# EAGLE design SensorNodePCB_set2_v2 (EAGLE 7.7.0)
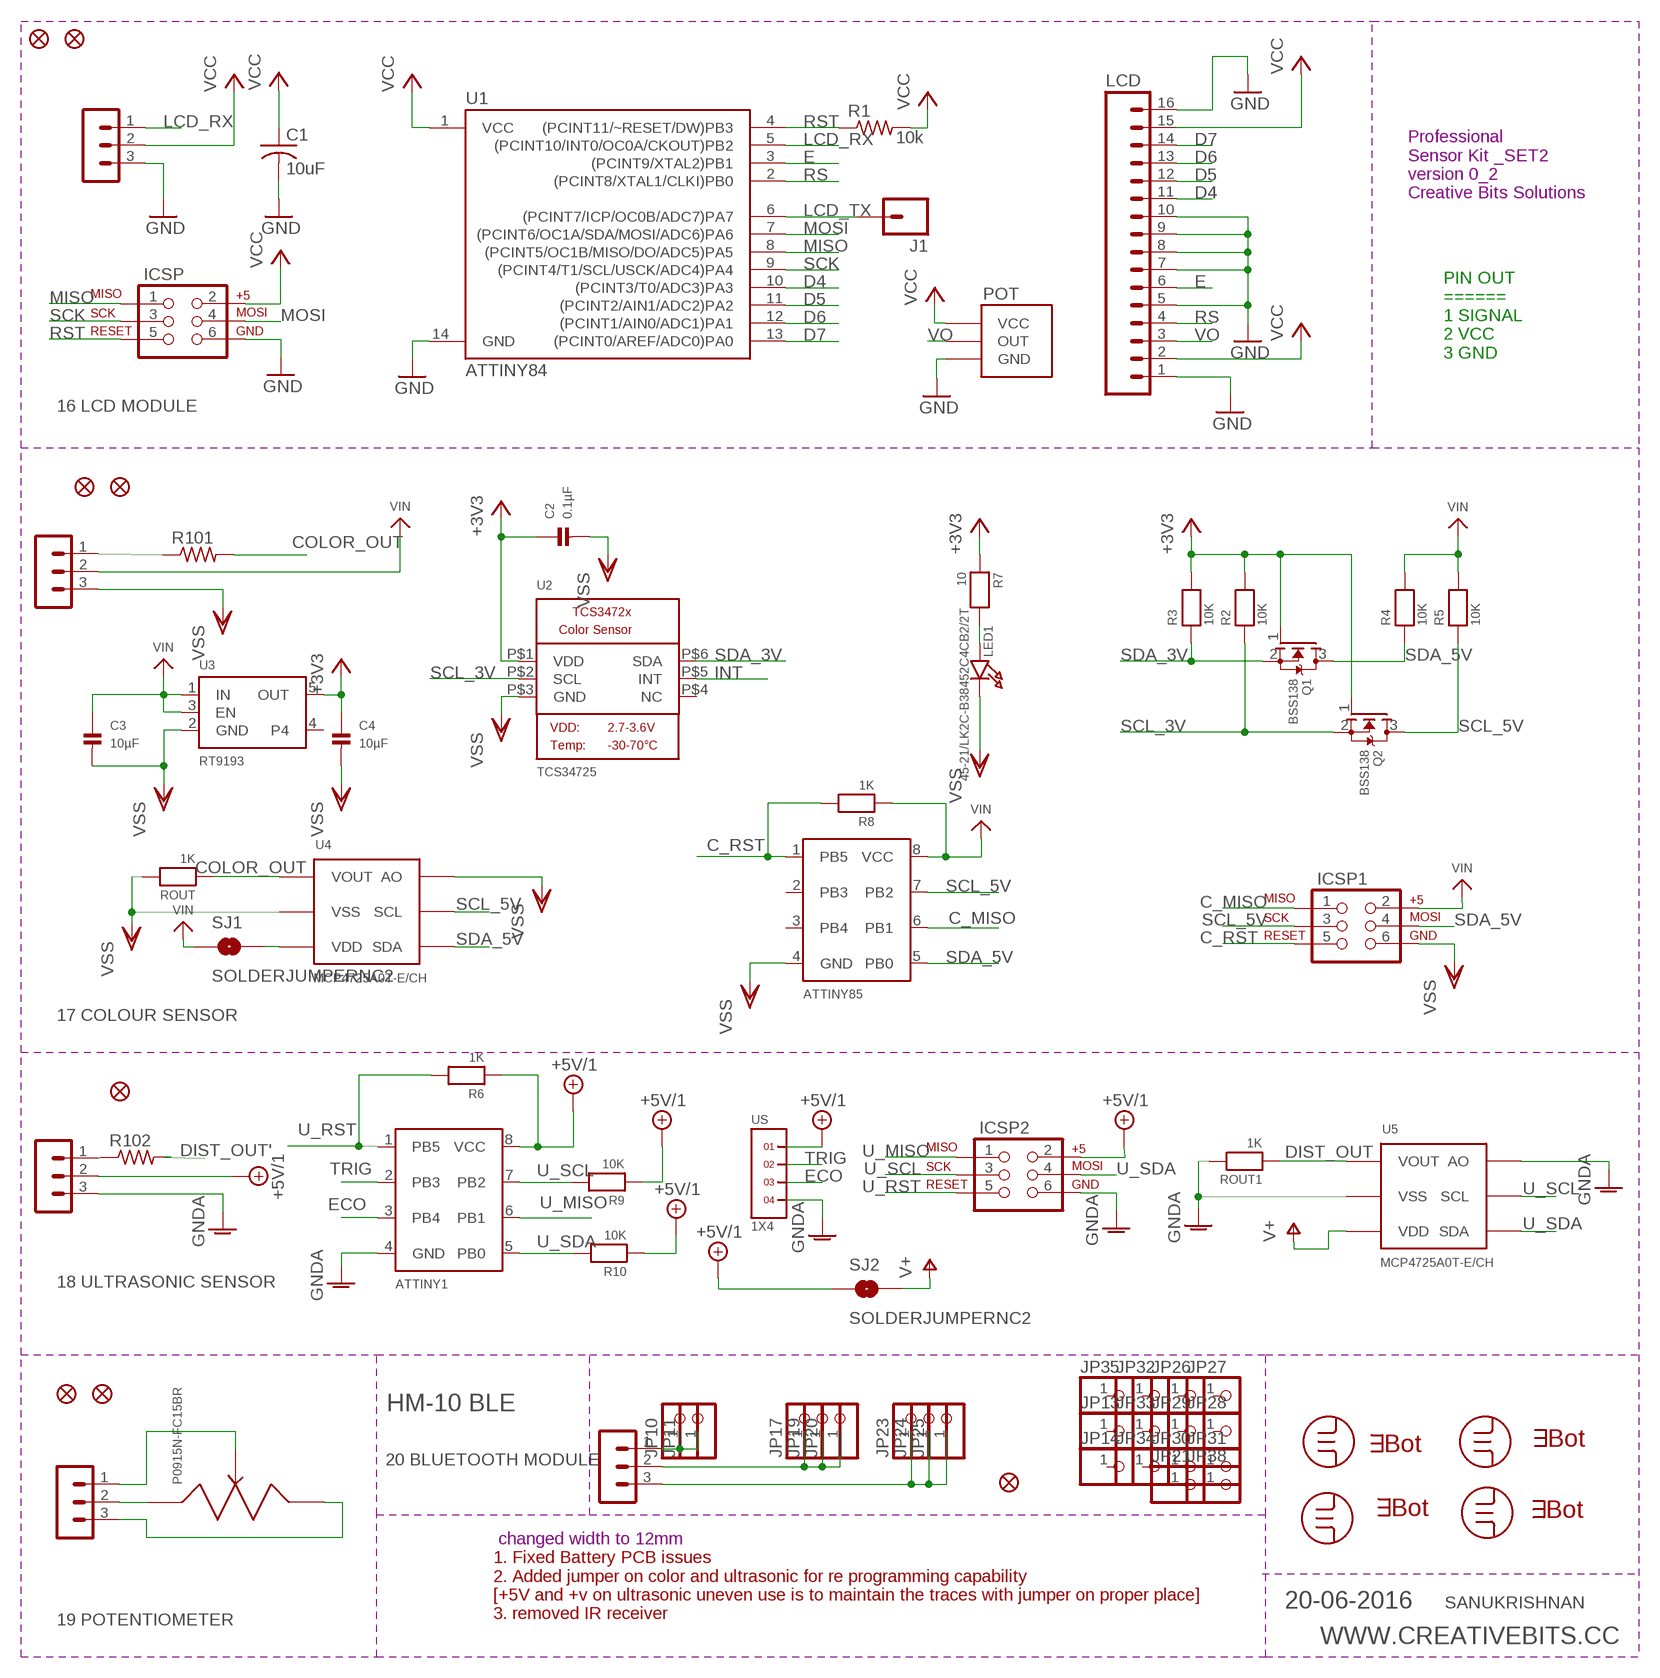
[diagram p0: schematic, sheet 1]

## Parts
ATTINY1  ATTINY45  [SOIC8]
ATTINY85  ATTINY45  [SOIC8]
C1  10uF  C-USC1206  [C1206]
C2  0.1µF  CAP_CERAMIC_0805  [_0805]
C3  10µF  CAP_CERAMIC_0805  [_0805]
C4  10µF  CAP_CERAMIC_0805  [_0805]
COLORSENSOR  MA03-1  [MA03-1]
ICSP  AVR_SPI_PRG_6NS  [2X3-NS]
ICSP1  AVR_SPI_PRG_6NS  [2X3-NS]
ICSP2  AVR_SPI_PRG_6NS  [2X3-NS]
J1  M01NOSILK-KIT  [1X01NS-KIT]
JP1  FIDUCIAL1X2  [FIDUCIAL-1X2]
JP2  FIDUCIAL1X2  [FIDUCIAL-1X2]
JP4  FIDUCIAL1X2  [FIDUCIAL-1X2]
JP6  FIDUCIAL1X2  [FIDUCIAL-1X2]
JP9  FIDUCIAL1X2  [FIDUCIAL-1X2]
JP10  PINHD-1X1CB  [1X01-CLEANBIG]
JP11  PINHD-1X1CB  [1X01-CLEANBIG]
JP12  FIDUCIAL1X2  [FIDUCIAL-1X2]
JP13  PINHD-1X1CB  [1X01-CLEANBIG]
JP14  PINHD-1X1CB  [1X01-CLEANBIG]
JP15  FIDUCIAL1X2  [FIDUCIAL-1X2]
JP17  PINHD-1X1CB  [1X01-CLEANBIG]
JP18  FIDUCIAL1X2  [FIDUCIAL-1X2]
JP19  PINHD-1X1CB  [1X01-CLEANBIG]
JP20  PINHD-1X1CB  [1X01-CLEANBIG]
JP21  PINHD-1X1CB  [1X01-CLEANBIG]
JP23  PINHD-1X1CB  [1X01-CLEANBIG]
JP24  PINHD-1X1CB  [1X01-CLEANBIG]
JP25  PINHD-1X1CB  [1X01-CLEANBIG]
JP26  PINHD-1X1CB  [1X01-CLEANBIG]
JP27  PINHD-1X1CB  [1X01-CLEANBIG]
JP28  PINHD-1X1CB  [1X01-CLEANBIG]
JP29  PINHD-1X1CB  [1X01-CLEANBIG]
JP30  PINHD-1X1CB  [1X01-CLEANBIG]
JP31  PINHD-1X1CB  [1X01-CLEANBIG]
JP32  PINHD-1X1CB  [1X01-CLEANBIG]
JP33  PINHD-1X1CB  [1X01-CLEANBIG]
JP34  PINHD-1X1CB  [1X01-CLEANBIG]
JP35  PINHD-1X1CB  [1X01-CLEANBIG]
JP38  PINHD-1X1CB  [1X01-CLEANBIG]
LCD  M16LONGPADS  [1X16_LONGPADS]
LCD_NODE  MA03-1  [MA03-1]
LED1  45-21/LK2C-B38452C4CB2/2T  LEDEV45-21  [EVERLIGHT_45-21]
POT  TRIMMER_EVN  [TRIMMER_EVN]
POT1  P0915N-FC15BR  [P0915N-FC15BR]
POTENTIOMETER  MA03-1  [MA03-1]
Q1  BSS138  MOSFET-NWIDE  [SOT23-WIDE]
Q2  BSS138  MOSFET-NWIDE  [SOT23-WIDE]
R1  10k  R-US_M0805  [M0805]
R2  10K  RESISTOR_0805  [_0805]
R3  10K  RESISTOR_0805  [_0805]
R4  10K  RESISTOR_0805  [_0805]
R5  10K  RESISTOR_0805  [_0805]
R6  1K  RESISTOR_0805  [_0805]
R7  10  RESISTOR_0805  [_0805]
R8  1K  RESISTOR_0805  [_0805]
R9  10K  RESISTOR_0805  [_0805]
R10  10K  RESISTOR_0805  [_0805]
R101  R-US_M0805  [M0805]
R102  R-US_M0805  [M0805]
ROUT  1K  RESISTOR_0805  [_0805]
ROUT1  1K  RESISTOR_0805  [_0805]
SJ1  SOLDERJUMPERNC2  [SJ_2S-NOTRACE]
SJ2  SOLDERJUMPERNC2  [SJ_2S-NOTRACE]
U1  ATTINY84  [SO14]
U2  TCS34725  LIGHT_TCS3472  [TCS3472_FN6]
U3  RT9193  VREG_SOT23-5  [SOT23-5]
U4  MCP4725  [MCP4725]
U5  MCP4725  [MCP4725]
U$30  EBOT_LOGO_6MMX6MM  [EBOT_6MMX6MM]
U$32  EBOT_LOGO_6MMX6MM  [EBOT_6MMX6MM]
U$33  EBOT_LOGO_6MMX6MM  [EBOT_6MMX6MM]
U$34  EBOT_LOGO_6MMX6MM  [EBOT_6MMX6MM]
U$35  EBOT_NAME_6MM  [EBOT_NAME_6MM]
U$37  EBOT_NAME_6MM  [EBOT_NAME_6MM]
U$38  EBOT_NAME_6MM  [EBOT_NAME_6MM]
U$39  EBOT_NAME_6MM  [EBOT_NAME_6MM]
ULTRASONICSENSOR  MA03-1  [MA03-1]
ULTRASONICSENSOR1  MA03-1  [MA03-1]
US  1X4  [1X4]

## Nets
+3V3: C2.1 C4.1 Q1.1(G) Q2.1(G) R2.2 R3.2 R7.1 U2.P$1(VDD) U3.5(OUT)
+5V/1: ATTINY1.8(VCC) ICSP2.2 R6.1 R9.1 R10.1 SJ2.1 ULTRASONICSENSOR.2 US.1
C_MISO: ATTINY85.6(PB1) ICSP1.1
C_RST: ATTINY85.1(PB5) ICSP1.5 R8.2
COLOR_OUT: R101.2 ROUT.1 U4.P$1(VOUT)
D4: LCD.11 U1.10((PCINT3/T0/ADC3)PA3)
D5: LCD.12 U1.11((PCINT2/AIN1/ADC2)PA2)
D6: LCD.13 U1.12((PCINT1/AIN0/ADC1)PA1)
D7: LCD.14 U1.13((PCINT0/AREF/ADC0)PA0)
DIST_OUT: R102.2 ROUT1.1 U5.P$1(VOUT)
DIST_OUT': R102.1 ULTRASONICSENSOR.1
E: LCD.6 U1.3((PCINT9/XTAL2)PB1)
ECO: ATTINY1.3(PB4) US.3
GND: C1.2 ICSP.6 LCD.1 LCD.5 LCD.7 LCD.8 LCD.9 LCD.10 LCD.16 LCD_NODE.3 POT.P$2(GND) U1.14(GND)
GNDA: ATTINY1.4(GND) ICSP2.6 ROUT1.2 U5.P$2(VSS) U5.P$6(AO) ULTRASONICSENSOR.3 US.4
INT: U2.P$5(INT)
LCD_RX: LCD_NODE.1 U1.5((PCINT10/INT0/OC0A/CKOUT)PB2)
LCD_TX: J1.1 U1.6((PCINT7/ICP/OC0B/ADC7)PA7)
MISO: ICSP.1 U1.8((PCINT5/OC1B/MISO/DO/ADC5)PA5)
MOSI: ICSP.4 U1.7((PCINT6/OC1A/SDA/MOSI/ADC6)PA6)
N$1: LED1.A R7.2
N$2: POT1.VCC POTENTIOMETER.2
N$3: SJ1.2 U4.P$3(VDD)
N$4: COLORSENSOR.1 R101.1
N$5: POT1.GND POTENTIOMETER.3
N$6: JP10.1 JP11.1 ULTRASONICSENSOR1.1
N$7: JP17.1 JP19.1 JP20.1 ULTRASONICSENSOR1.2
N$8: JP23.1 JP24.1 JP25.1 ULTRASONICSENSOR1.3
POT_OUT: POT1.OUT POTENTIOMETER.1
RS: LCD.4 U1.2((PCINT8/XTAL1/CLKI)PB0)
RST: ICSP.5 R1.1 U1.4((PCINT11/~RESET/DW)PB3)
SCK: ICSP.3 U1.9((PCINT4/T1/SCL/USCK/ADC4)PA4)
SCL_3V: Q2.2(S) R2.1 U2.P$2(SCL)
SCL_5V: ATTINY85.7(PB2) ICSP1.3 Q2.3(D) R5.1 U4.P$5(SCL)
SDA_3V: Q1.2(S) R3.1 U2.P$6(SDA)
SDA_5V: ATTINY85.5(PB0) ICSP1.4 Q1.3(D) R4.1 U4.P$4(SDA)
TRIG: ATTINY1.2(PB3) US.2
U_MISO: ATTINY1.6(PB1) ICSP2.1
U_RST: ATTINY1.1(PB5) ICSP2.5 R6.2
U_SCL: ATTINY1.7(PB2) ICSP2.3 R9.2 U5.P$5(SCL)
U_SDA: ATTINY1.5(PB0) ICSP2.4 R10.2 U5.P$4(SDA)
V+: SJ2.2 U5.P$3(VDD)
VCC: C1.1 ICSP.2 LCD.2 LCD.15 LCD_NODE.2 POT.P$1(VCC) R1.2 U1.1(VCC)
VIN: ATTINY85.8(VCC) C3.1 COLORSENSOR.2 ICSP1.2 R4.2 R5.2 R8.1 SJ1.1 U3.1(IN) U3.3(EN)
VO: LCD.3 POT.P$3(OUT)
VSS: ATTINY85.4(GND) C2.2 C3.2 C4.2 COLORSENSOR.3 ICSP1.6 LED1.K(C) ROUT.2 U2.P$3(GND) U3.2(GND) U4.P$2(VSS) U4.P$6(AO)
Unconnected: ATTINY85.2(PB3) ATTINY85.3(PB4) JP13.1 JP14.1 JP21.1 JP26.1 JP27.1 JP28.1 JP29.1 JP30.1 JP31.1 JP32.1 JP33.1 JP34.1 JP35.1 JP38.1 U2.P$4(NC) U3.4

## Notes on the sheet
- Professional
  Sensor Kit _SET2
  version 0_2
  Creative Bits Solutions
- PIN OUT
  ======
  1 SIGNAL
  2 VCC
  3 GND
- 16 LCD MODULE
- 17 COLOUR SENSOR
- 18 ULTRASONIC SENSOR
- HM-10 BLE
- 20 BLUETOOTH MODULE
- changed width to 12mm
- 20-06-2016 | SANUKRISHNAN
- 1. Fixed Battery PCB issues
  2. Added jumper on color and ultrasonic for re programming capability
  [+5V and +v on ultrasonic uneven use is to maintain the traces with jumper on proper place]
  3. removed IR receiver
- 19 POTENTIOMETER
- WWW.CREATIVEBITS.CC

## Library data of the parts
ATTINY1 ATTINY85 = attiny45:ATTINY45
C1 = adafruit:C-US: CAPACITOR, American symbol
C2-C4 = microbuilder:CAP_CERAMIC: Ceramic Capacitors 0402 - 0402 Surface Mount Capacitors 16pF 50V 5% [Digikey: 445-4899-2-ND] 18pF 50V 5% [Digikey: 490-1281-2-ND] 22pF 50V 5% [Digikey: 490-1283-2-ND] 68pF 50V 5% [Digikey: 490-1289-2-ND] 0.1uF 10V 10% [Digikey: 490-1318-2-ND] 1.0uF 6.3V 10% [Digikey: 490-1320-2-ND] 0603 - 0603 Surface Mount Capacitors 16 pF 50V 5% [Digikey: 445-5051-2-ND] 22 pF 50V [Digikey: PCC220ACVTR-ND] 33 pF 50V 5% [Digikey: 490-1415-1-ND] 56pF 50V 5% [Digikey: 490-1421-1-ND] 220pF 50V 5% [Digikey: 445-1285-1-ND] 680 pF 50V 2200 pF 50V 5% C0G [Digikey: 445-1297-1-ND] 5600 pF 100V 5% X7R [Digikey: 478-3711-1-ND] 0.1 µF 25V 10% [Digikey: PCC2277TR-ND] 0.22 µF 16V 10% X7R [Digikey: 445-1318-1-ND] 1.0 µF 25V 10% [Digikey: 445-5146-2-ND] 0603 - RF Specific 3pF 250V +/-0.1pF RF [Digikey: 712-1347-1-ND] 18 pF 250V 5% [Digikey: 478-3505-1-ND or 712-1322-1-ND] 56 pF 250V 5% C0G RF [Digikey: 490-4867-1-ND] 68 pF 250V RF [Digikey: 490-4868-1-ND] 0805 - 0805 Surface Mount Capacitors 220 pF 250V 2% RF Ceramic Capacitor [Digikey: 712-1398-1-ND] 1000 pF 50V 2% NP0 Ceramic Capacitor [Digikey: 478-3760-1-ND] 0.1 µF 25V 10% Ceramic Capacitor [Digikey: PCC1828TR-ND] 1.0 µF 16V 10% Ceramic Capacitor[Digikey: 490-1691-2-ND] 10.0 µF 10V 10% Ceramic Capacitor[Digikey: 709-1228-1-ND] 10.0 uF 16V 10% Ceramic Capacitor [Digikey: 478-5165-2-ND] 47 uF 6.3V 20% Ceramic Capacitor [Digikey: 587-1779-1-ND or 399-5506-1-ND] 1206 - 1206 Surface Mount Capacitors 47uF 10V 20% Ceramic Capacitor [Digikey: 490-5528-1-ND or 399-5508-1-ND or 445-6010-1-ND] 100uF 6.3V -20%, +80% Y5V Ceramic Capacitor (Digikey: 490-4512-1-ND, Mouser: 81-GRM31CF50J107ZE1L)
COLORSENSOR LCD_NODE POTENTIOMETER ULTRASONICSENSOR ULTRASONICSENSOR1 = con-lstb:MA03-1: PIN HEADER; OC_FARNELL: unknown; OC_NEWARK: unknown
ICSP ICSP1 ICSP2 = SparkFun-Connectors:AVR_SPI_PRG_6: AVR ISP 6 Pin This is the reduced ISP connector for AVR programming. Common on Arduino. This footprint will take up less PCB space and can be used with a 10-pin to 6-pin adapter such as SKU: BOB-08508 **Special note about "TEST_POINT" package. The stop mask is on the top side, so if you want your programming test points to be on the bottom of your board, make sure to place this package on the bottom side of the board. This also ensure that the orientation to program from the bottom side will be correct.
J1 = SparkFun-Connectors:M01: Header 1 Standard 1-pin 0.1" header. Use with straight break away headers (SKU : PRT-00116), right angle break away headers (PRT-00553), swiss pins (PRT-00743), machine pins (PRT-00117), and female headers (PRT-00115). SMTSO-256-ET is a "flush mount" nut for a 4-40 screw. The older package used to be too tight, and did not allow it to sit properly thru the drill hit. The latest (0.165DIA) fits nice and snug.
JP1 JP2 JP4 JP6 JP9 JP12 JP15 JP18 = attiny84SparkFun:FIDUCIAL: Fiducial Alignment Points Various fiducial points for machine vision alignment.
JP10 JP11 JP13 JP14 JP17 JP19-JP21 JP23-JP35 JP38 = adafruit:PINHD-1X1: Pin header 1x1 for 0.1" spacing With round pins
LCD = SparkFun-Connectors:M16: 1x16 .1" header
LED1 = microbuilder:LED: LED 0603 - 0603 Surface Mount Package 2mA: Green LED - Low Power (3.9mcd, 2ma, 1.7Vf) - Digikey: 475-2709-2-ND Orange LED - Low Power (9.8mcd, 2ma, 1.8Vf) - Digikey: 475-1194-2-ND Red LED - Low Power (5mcd, 2ma, 1.8Vf) - Digikey: 475-1195-2-ND Yellow LED - Low Power (7mcd, 2ma, 1.8Vf) - Digikey: 475-1196-2-ND 5mA: Blue LED - Low Power (17mcd, 5ma, 2.9Vf) - Digikey: LNJ937W8CRACT-ND 0805 - 0805 Surface Mount Package 2mA: Red LED (8.8mcd, 2mA, 1.8Vf, Clear) - Low Power [Digikey: 475-2510-1-ND] Green LED (5mcd, 2mA, 1.8Vf, Clear) - Low Power [Digikey: 475-2730-1-ND] Yellow LED (11.3mcd, 2mA, 1.8Vf, Clear) - Low Power [Digikey: 475-2555-1-ND] 20mA: Red LED (104mcd, 20mA, Diffused) - LS R976 [Digikey: 475-1278-6-ND] Red LED (12mcd, 20mA, 2.0Vf, Clear) - APT2012EC [Digikey: 754-1128-1-ND] Green LED (15mcd, 20mA, 2.2Vf, Clear) - APT2012GC [Digikey: 754-1131-1-ND] Orange LED (160mcd, 20mA, 2.1Vf, Clear) - APT2012SECK [Digikey: 754-1130-1-ND] 1206 - 1206 Surface Mount Package Green LED (26mcd, 20mA, Diffused) - LG N971 [Digikey: 475-1407-6-ND] Red LED (15mcd, 20mA, Diffused) - LH N974 [Digikey: 475-1416-6-ND] Cree - Cree High-Power Surface Mount LEDs XPEBWT-L1-0000-00D50 - White 111lm 350mA 2.9Vf 6200K 110° XTEAWT-00-0000-00000LEE3 - White 114lm 350mA 2.85Vf 5000K 115° Everlight - Everlight 45-21 Series Surface Mount LEDs 45-21/QK2C-B2832AC2CB2/2T - Warm White 2000mcd 20mA 3.25Vf 3050K 120° 45-21/LK2C-B38452C4CB2/2T - Nuetral White 2000mcd 20mA 3.25Vf 4150K 120° 45-21/LK2C-B50634C6CB2/2T - Cold White 2200mcd 20mA 3.25Vf 5650K 120°
POT = TRIMMER:TRIMMER_EVN
POT1 = P0915N-FC15BR:P0915N-FC15BR
Q1 Q2 = microbuilder:MOSFET-N: N-Channel Mosfet LEGEND VDS: Voltage Drain-Source ID: Drain Current RDS(ON): Drain-Source On-State Resistance VGS(TH): Gate-Source Threshold Voltage CISS: Drain-Source Input Capacitance SOT-23 Name VDS ID RDS(ON) VGS(TH) CISS Order Number 2N7002E 60V 260mA 2.5 Ohm 2.5V @ 250uA 26.7pF @ 25V 2N7002ET1GOSTR-ND BSH103 30V 850mA 400 mOhm 400mV @ 1mA 83pF @ 24V BSH103,235-ND BSS138 60V 320mA 1.6 Ohm 1.5V @ 250uA 50pF @ 10V Mouser: 771-BSS138PW115 DMN2075U-7 20V 4.2A 38 mOhm 1V @ 250 uA 594.3pF @ 10V DMN2075U-7DICT-ND * BSS138 good choice for I2C level-shifting
R1 R101 R102 = adafruit:R-US_: RESISTOR, American symbol
R2-R10 ROUT ROUT1 = microbuilder:RESISTOR: Resistors 0402 - 0402 Surface Mount Package 22 Ohm 1% 1/16W [Digikey: 311-22.0LRTR-ND] 33 Ohm 5% 1/16W 1.0K 5% 1/16W 1.5K 5% 1/16W 2.0K 1% 1/16W 10.0K 1% 1/16W [Digikey: 311-10.0KLRTR-ND] 10.0K 5% 1/16W [Digikey: RMCF0402JT10K0TR-ND] 12.1K 1% 1/16W [Digikey: 311-22.0LRTR-ND] 100.0K 5% 1/16W 0603 - 0603 Surface Mount Package 0 Ohm 1/10 Watt 1% Resistor 15 Ohm 1/10 Watt 1% Resistor 33 Ohm 1/10 Watt 1% Resistor 49.9 Ohm 1/10 Watt 1% Resistor 100 Ohm 1/10 Watt 1% Resistor 150 Ohm 1/10 Watt 1% Resistor 240 Ohm 1/10 Watt 1% Resistor 390 Ohm 1/10 Watt 1% Resistor 560 Ohm 1/10 Watt 1% Resistor 680 Ohm 1/10 Watt 1% Resistor 750 Ohm 1/10 Watt 1% Resistor 1.0K Ohm 1/10 Watt 1% Resistor 1.5K Ohm 1/10 Watt 1% Resistor 2.0K Ohm 1/10 Watt 1% Resistor 2.2K Ohm 1/10 Watt 1% Resistor 3.3K Ohm 1/10 Watt 1% Resistor 4.7K Ohm 1/10 Watt 1% Resistor 10.0K Ohm 1/10 Watt 1% Resistor 12.0K Ohm 1/10 Watt 1% Resistor 12.1K Ohm 1/10 Watt 1% Resistor 20.0K Ohm 1/10 Watt 1% Resistor 33.0K Ohm 1/10 Watt 1% Resistor 100.0K Ohm 1/10 Watt 1% Resistor 0805 - 0805 Surface Mount Package 0 Ohm 1/8 Watt 1% Resistor 33 Ohm 1/8 Watt 1% Resistor 100 Ohm 1/8 Watt 1% Resistor 150 Ohm 1/8 Watt 1% Resistor 200 Ohm 1/8 Watt 1% Resistor 240 Ohm 1/8 Watt 1% Resistor 330 Ohm 1/8 Watt 1% Resistor 390 Ohm 1/8 Watt 1% Resistor 470 Ohm 1/8 Watt 1% Resistor 1.0K Ohm 1/8 Watt 1% Resistor 1.5K Ohm 1/8 Watt 1% Resistor 2.0K Ohm 1/8 Watt 1% Resistor 4.7K Ohm 1/8 Watt 1% Resistor 5.1K Ohm 1/8 Watt 1% Resistor 5.6K Ohm 1/8 Watt 1% Resistor 10.0K Ohm 1/8 Watt 1% Resistor 22.0K Ohm 1/8 Watt 1% Resistor 33.0K Ohm 1/8 Watt 1% Resistor 100K Ohm 1/8 Watt 1% Resistor 1206 - 1206 Surface Mount Package 2012 - 2010 Surface Mount Package 0.11 Ohm 1/2 Watt 1% Resistor - Digikey: RHM.11UCT-ND
SJ1 SJ2 = SparkFun-Passives:SOLDERJUMPER: Solder Jumper Standard SMD solder jumper. Used to automate production. Two varients : Normally Open and Normally Closed are the same, but have different paste layers. NC will have a large amount of paste and should jumper during reflow.
U1 = SparkFun-DigitalIC:ATTINY84: Atmel 14-pin 2/4/8kB flash uC; PROD_ID: IC-11285
U2 = microbuilder:LIGHT_TCS3472: TCS3472 RGB + Clear Color Sensor VDD: 2.7-3.6V Temp: -30 - 70°C IR light blocking filter 3,800,000:1 Dynamic Range 2.5µA sleep state Part IDs TCS34725: I2C bus logic = VDD, I2C address: 0x29 TCS34727: I2C bus logic = 1.8V, I2C address: 0x29
U3 = microbuilder:VREG_SOT23-5: SOT23-5 Fixed Voltage Regulators To better organise some of the SOT23-5 fixed voltage regulators in this library, this new part was created. Part Current Out V Out V In V Dropout Digikey Part No. ADP121 150mA 3.3V 3.4-5.5V 0.09V @ 150mA ADP121-AUJZ33R7CT-ND ADP121 150mA 3.0V 3.1-5.5V 0.09V @ 150mA ADP121-AUJZ30R7CT-ND ADP122 300mA 3.3V 3.4-5.5V 0.085V @ 300mA ADP122AUJZ-3.3-R7CT-ND ADP1712 300mA 3.3V 3.5-5.5V 0.17V @ 300mA ADP1712AUJZ-3.3-R7TR-ND AP7311 (Low Cost) 150mA 3.3V 3.5-6V 0.15V @ 150mA AP7311-33WG-7DICT-ND LD39015M18R 150mA 1.8V 1.9V-5.5V 0.08V @ 100mA 497-6977-1-ND MCP1824T-3302E/OT 300mA 3.3V 3.5V-6V 0.2V @ 300mA MCP1824T-3302E/OTCT-ND MIC5205-2.5YM5 TR 150mA 2.5V 2.7-16V 0.165V @ 150mA 576-1257-2-ND MIC5205-3.0YM5 TR 150mA 3.0V 3.2V-16V 0.165V @ 150mA 576-1258-2-ND MIC5205-3.3YM5 TR 150mA 3.3V 3.5V-16V 0.165V @ 150mA 576-1259-2-ND TPS780330220 150mA 3.3V+2.2V 3.6-5.5V 250mV Max 296-23332-1-ND TDA3663/N1,135 100mA 3.3V 3.5-45V 0.18V @ 50mA 568-5343-1-ND
U4 U5 = MCP4725:MCP4725
U$30 U$32-U$34 = EbotLogos:EBOT_LOGO_6MMX6MM
U$35 U$37-U$39 = EbotLogos:EBOT_NAME_6MM
US = headers(.1in):1X4

## Net classes
0 default: width 0.178 mm, drill 0.305 mm, clearance 0.178 mm

## Board
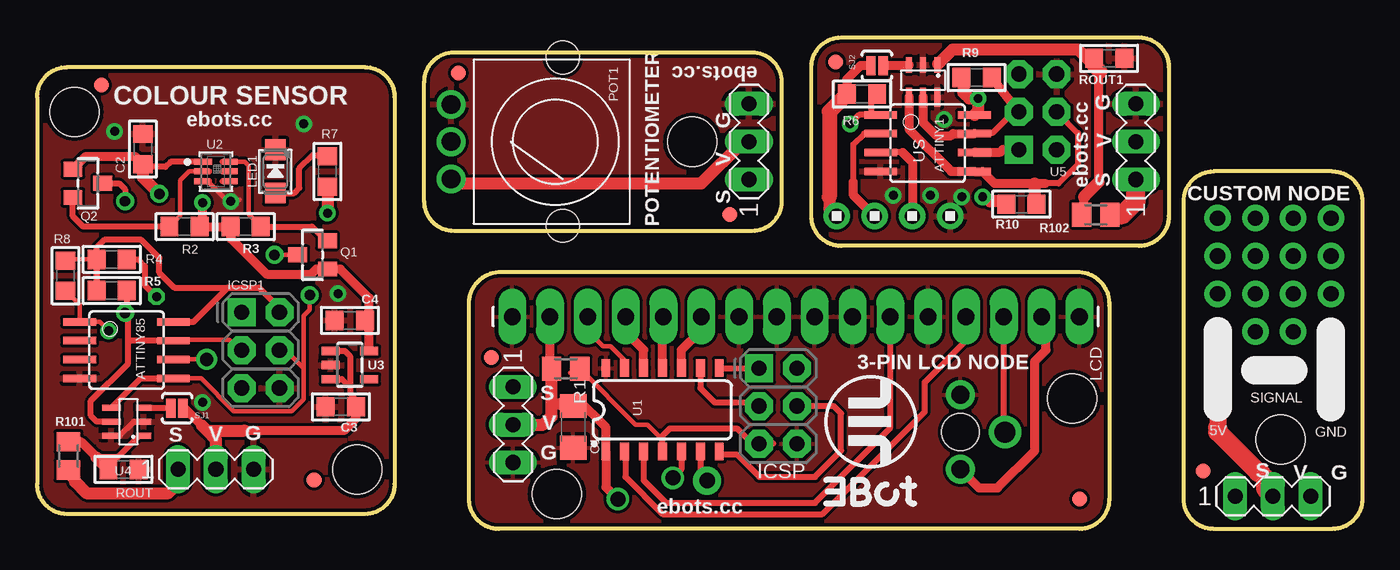
[diagram p1: board, top side]
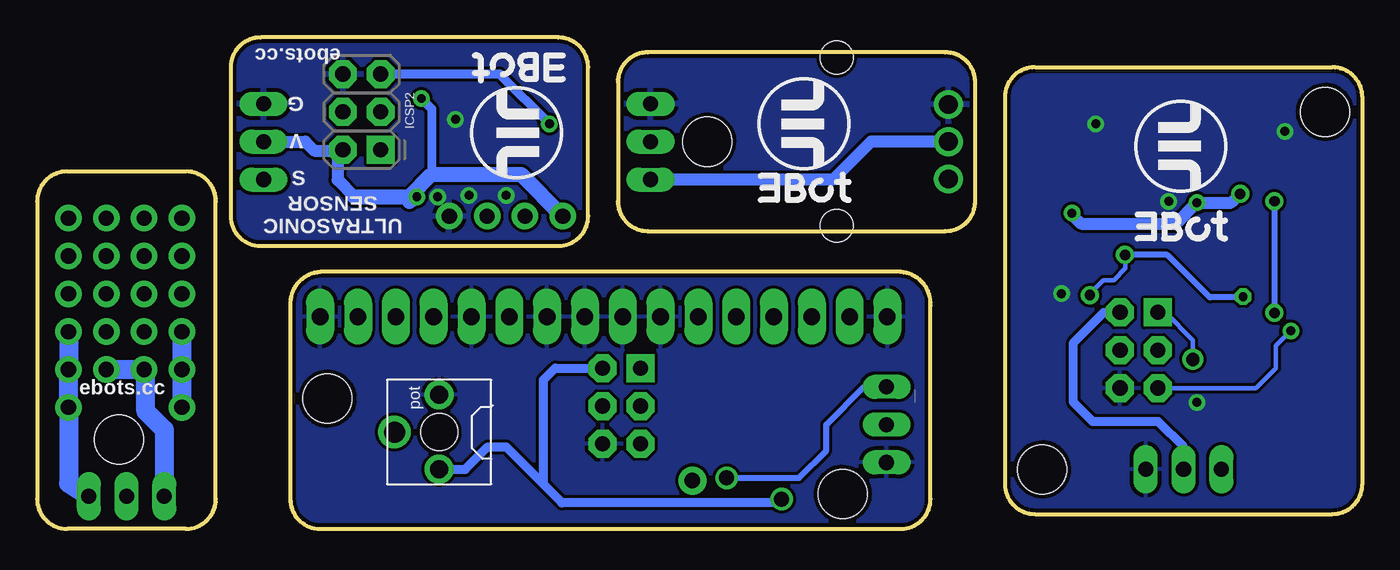
[diagram p2: board, bottom side, seen from below]

Size 89 x 33 mm. Coordinates in mm from the lower left corner, seen from the top.
Outline: 26,22 26,30 arc-90 28,32 48,32 arc-90 50,30 50,22 arc-90 48,20 28,20 arc-90 26,22
Outline: 52,21 52,31 arc-90 54,33 74,33 arc-90 76,31 76,21 arc-90 74,19 54,19 arc-90 52,21
Outline: 22,31 2,31 arc90 0,29 0,3 arc90 2,1 22,1 arc90 24,3 24,29 arc90 22,31
Outline: 29,2 29,15 arc-90 31,17.25 70,17.25 arc-90 72,15 72,2 arc-90 70,0 31,0 arc-90 29,2
Outline: 87,24 arc-90 89,22 89,2 arc-90 87,0 79,0 arc-90 77,2 77,22 arc-90 79,24 87,24
Copper layers (1*16): Top 0.035mm / dielectric 1.5mm / Bottom 0.035mm
Design rules "SparkFun": minimum track width 8mil, minimum drill 20mil, track to track 8mil, track to pad 8mil, pad to pad 8mil, via to via 8mil, smd to smd 8mil, copper to edge 10mil, drill to drill 8mil, minimum pad ring 12mil, minimum via ring 10mil, stop-mask expansion 4mil, vias tented up to drill 25mil, thermal gap 10mil

### Footprints (pad centres in the part's own frame; a part is rotated, then mirrored left to right if it is on the bottom)
SOIC8 = smd 0.5 x 2.2: 1 -1.905,-3.154; 2 -0.645,-3.154; 3 0.625,-3.154; 4 1.895,-3.154; 5 1.905,3.154; 6 0.635,3.154; 7 -0.635,3.154; 8 -1.905,3.154
C1206 = smd 1.6 x 1.8: 1 -1.4,0; 2 1.4,0
_0805 = smd 1.2 x 1.3: 1 -1.016,0; 2 1.016,0
MA03-1 = drill 1.016 long: 1 -2.54,0; 2 0,0; 3 2.54,0
2X3-NS = drill 1.016 pad 1.88 square: 1 -2.54,-1.27 | drill 1.016 pad 1.88 octagon: 2 -2.54,1.27; 3 0,-1.27; 4 0,1.27; 5 2.54,-1.27; 6 2.54,1.27
1X01NS-KIT = drill 1.016 pad 1.88: 1 0,0
FIDUCIAL-1X2 = smd 1 x 1: 1 0,0
STAND-OFF = hole 3.302: 0,0
1X01-CLEANBIG = drill 1.016 pad 1.778: 1 0,0
1X16_LONGPADS = drill 1.118 pad 1.88 long: 1 0,0; 2 2.54,0; 3 5.08,0; 4 7.62,0; 5 10.16,0; 6 12.7,0; 7 15.24,0; 8 17.78,0; 9 20.32,0; 10 22.86,0; 11 25.4,0; 12 27.94,0; 13 30.48,0; 14 33.02,0; 15 35.56,0; 16 38.1,0
EVERLIGHT_45-21 = smd 1.4 x 1.4: A -1.45,0; K 1.45,0
TRIMMER_EVN = drill 1.2 pad 1.93: P$1 -2.5,0; P$2 2.5,0 | drill 1.4 pad 2.184: P$3 0,3 | hole 2.5: 0,0
P0915N-FC15BR = drill 1.25 pad 1.93: GND -2.5,0; OUT 0,0; VCC 2.5,0 | hole 2.2: 5.65,7.5; -5.65,7.5
SOT23-WIDE = smd 1 x 1.27: 1 -0.95,-1; 2 0.95,-1; 3 0,1
M0805 = smd 1.3 x 1.6: 1 -0.95,0; 2 0.95,0
SJ_2S-NOTRACE = smd 0.635 x 1.27: 1 -0.401,0; 2 0.413,0
SO14 = smd 0.6 x 1.2: 1 -3.81,-2.8; 2 -2.54,-2.8; 3 -1.27,-2.8; 4 0,-2.8; 5 1.27,-2.8; 6 2.54,-2.8; 7 3.81,-2.8; 8 3.81,2.8; 9 2.54,2.8; 10 1.27,2.8; 11 0,2.8; 12 -1.27,2.8; 13 -2.54,2.8; 14 -3.81,2.8
TCS3472_FN6 = smd 1.2 x 0.4: P$1 -0.85,0.65 | smd 1 x 0.4: P$2 -0.95,0; P$3 -0.95,-0.65; P$4 0.95,-0.65; P$5 0.95,0; P$6 0.95,0.65
SOT23-5 = smd 0.55 x 1.2: 1 -0.95,-1.3; 2 0,-1.3; 3 0.95,-1.3; 4 0.95,1.3; 5 -0.95,1.3
MCP4725 = smd 0.4 x 1.016: P$1 -0.95,-1.15; P$2 0,-1.15; P$3 0.95,-1.15 | smd 0.4 x 1.27: P$4 0.95,1.016; P$5 0,1.016; P$6 -0.95,1.016
1X4 = drill 1.016 pad 1.778: 1 0,0; 2 2.54,0; 3 5.08,0; 4 7.62,0

### Placement (x,y rotation side)
ATTINY1  59.8,25.9 270 top
ATTINY85  6,12 270 top
C1  36,6.85 270 top
C2  7.1,25.5 90 top
C3  20.4,8.2 180 top
C4  21,14 180 top
COLORSENSOR  12,4 0 top
ICSP  49.75,8.25 270 top
ICSP1  15,12 270 top
ICSP2  67.2,28 90 bottom
J1  45,3.25 90 top
JP1  28.3,30.6 0 top
JP2  30.5,11.5 90 top
JP3  STAND-OFF  [STAND-OFF]  69.5,8.75 180 top
JP4  70,2 90 top
JP5  STAND-OFF  [STAND-OFF]  2.5,28 0 top
JP6  46.5,21.1 0 top
JP7  STAND-OFF  [STAND-OFF]  83.5,6 90 top
JP8  STAND-OFF  [STAND-OFF]  21.5,4 0 top
JP9  78.3,3.9 0 top
JP10  81.82,10.7 0 top
JP11  84.36,10.7 0 top
JP12  18.6,3.3 0 top
JP13  86.9,20.86 0 top
JP14  84.36,20.86 0 top
JP15  53.64,31.34 0 top
JP16  STAND-OFF  [STAND-OFF]  44,26 90 top
JP17  79.28,8.16 0 top
JP18  4.3,29.8 0 top
JP19  79.28,13.24 0 top
JP20  79.28,10.7 0 top
JP21  81.82,20.86 0 top
JP22  STAND-OFF  [STAND-OFF]  34.9,2.35 180 top
JP23  86.9,8.16 0 top
JP24  86.9,10.7 0 top
JP25  86.9,13.24 0 top
JP26  81.82,18.32 0 top
JP27  84.36,18.32 0 top
JP28  86.9,18.32 0 top
JP29  84.36,13.24 0 top
JP30  79.28,15.78 0 top
JP31  86.9,15.78 0 top
JP32  81.82,13.24 0 top
JP33  84.36,15.78 0 top
JP34  81.82,15.78 0 top
JP35  79.28,18.32 0 top
JP38  79.28,20.86 0 top
LCD  70,14.25 180 top
LCD_NODE  31.95,7 270 top
LED1  16,24 90 top
POT  62,6.5 90 bottom
POT1  27.8,26 270 top
POTENTIOMETER  47.8,26 90 top
Q1  18.5,18.4 90 top
Q2  3.4,23.2 270 top
R1  35.5,10.75 180 top
R2  9.9,20.3 0 top
R3  14,20.3 180 top
R4  5,18.1 180 top
R5  5,16 180 top
R6  55.4,29.2 0 top
R7  19.5,24 90 top
R8  1.9,17 270 top
R9  63.1,30.3 0 top
R10  66.1,21.8 0 top
R101  2.1,4.9 90 top
R102  71.1,21.1 180 top
ROUT  5.8,4 0 top
ROUT1  72,31.6 0 top
SJ1  9.4,8.1 180 top
SJ2  56.4,31.1 0 top
U1  42,8 0 top
U2  12,24 0 top
U3  21,11 270 top
U4  6,7.2 90 top
U5  59.5,30 180 top
U$30  56,7.2 0 top
U$32  37.5,27.2 0 bottom
U$33  56.8,26.6 180 bottom
U$34  12.2,25.7 0 bottom
U$35  53,1.6 0 top
U$37  40.4,22 0 bottom
U$38  53.7,31.9 180 bottom
U$39  15.1,19.4 0 bottom
ULTRASONICSENSOR  73.8,26 90 top
ULTRASONICSENSOR1  83,2.2 0 top
US  53.7,21 0 top

### Tracks (layer width: path | path; a pad name or v marks a point on that pad's centre or on a via)
+3V3  (via drill 0.6, 0.7)
  Top 0.305: 11.1,24.7 U2.P$1
  Top 0.406: 22.3,13.72 C4.1 22,14.02 | 19.25,17.2 Q1.1 | U2.P$1 8.95,24.65 8.6,24.3 7.28,24.3 C2.1
  Top 0.61: U3.5 22.3,14.1 | 22.3,14.1 22.3,15.5 20.35,17.45 Q1.1 18.75,17.45 18.4,17.1 15.4,17.1 12.98,19.52 R3.2 R2.2 11.1,20.48 v11.1,21.9 | C4.1 22.12,14.1 22.3,14.1 | Q2.1 3.27,25.02 6.57,25.02 C2.1
  Top 0.813: C2.1 7.1,23.6 v8.2,22.5 | R7.1 v19.5,21.2
  Bottom 0.813: v8.2,22.5 8.8,21.9 v11.1,21.9 12.5,20.5 18.9,20.5 19.5,21.1 v19.5,21.2
+5V/1  (via drill 0.6)
  Top 0.61: SJ2.1 55.3,31.1 54.38,30.18 R6.1
  Top 0.813: 53.2,22.3 53.2,21.5 US.1 | R10.1 64.88,22 64,22 63.7,22.3 v63.5,22.3 | R9.1 62.2,30.18 62.2,29.3 62.6,28.9 v63.2,28.9 63.2,28.05 ATTINY1.8
  Top 1.016: R6.1 53.2,28.02 53.2,22.3
  Bottom 0.61: v63.2,28.9 62.5,28.2 62.5,23.8
  Bottom 0.813: ULTRASONICSENSOR.2 71,26 70.4,25.4 68.83,25.4 | 68.83,25.4 ICSP2.2 | 68.83,25.4 68.83,23.43 67.7,22.3
  Bottom 1.016: 67.7,22.3 64,22.3 | 64,22.3 62.5,23.8 56.5,23.8 US.1 | v63.5,22.3 64,22 64,22.3
C_MISO  (via drill 0.9)
  Top 0.305: ATTINY85.6 9.19,11.4 v11.38,11.38
  Bottom 0.305: ICSP1.1 13.24,14.54 11.38,12.68 v11.38,11.38
C_RST  (via drill 0.6)
  Top 0.305: R8.2 2.85,15.04 ATTINY85.1 4.2,13.9 v4.8,13.3
  Bottom 0.305: ICSP1.5 7.14,9.46 5.8,10.8 5.8,12.3 v4.8,13.3
COLOR_OUT
  Top 0.406: U4.P$1 6.85,6.25 5.4,4.8 4,4.8 3.99,4.79
  Top 0.61: 4,4.8 2.95,5.85 R101.2
  Top 0.813: 3.99,4.79 ROUT.1
D4
  Top 0.61: U1.10 43.27,12.02 44.5,13.25 44.5,14.9 LCD.11
D5
  Top 0.61: U1.11 42,14.94 LCD.12
D6
  Top 0.61: U1.12 40.73,12.02 39.5,13.25 39.5,14.98 LCD.13
D7
  Top 0.305: U1.13 39.5,10.84 39.5,11.25 38.5,12.25 38,12.25 36.98,13.27 LCD.14
DIST_OUT
  Top 0.6: 71.3,23.3 71.3,30.8
  Top 0.61: U5.P$1 60.5,31.2 | R102.2 70.15,21.45 70.35,21.65 70.3,21.7 70.3,22.3
  Top 0.813: 60.5,31.2 61.5,32.2 69.9,32.2 71.3,30.8 | 70.3,22.3 71.3,23.3
  Top 1.016: 71.4,30.7 71.3,30.8 70.98,31.12 ROUT1.1
DIST_OUT'
  Top 0.61: 73.8,21.55 73.8,22
  Top 1.27: R102.1 72.9,21.1 73.8,22 ULTRASONICSENSOR.1
E
  Top 0.406: U1.3 40.75,5.18 40.75,3.25 42.25,1.75 52.25,1.75 57.3,6.8 LCD.6
ECO
  Top 0.406: 58.12,25.27 ATTINY1.3
  Top 0.61: 58.12,25.27 58.78,24.62 US.3
GND
  pour Top: 28,0 72,0 71.75,17.25 27.75,17.25
  pour Bottom: 29,0 72,0 72,17.25 29,17.25
GNDA  (via drill 0.6)
  other vias: 57.5,22.4 62.1,22.3 60.9,27.5 60,22.4
  pour Bottom: 52.3,32.7 52.3,19.1 76.3,19.2 75.9,33
  pour Top: 52.6,18.9 52.5,32.5 76.1,33.1 75.9,19
LCD_RX  (via drill 1)
  Top 0.406: U1.5 43.27,4 v42.7,3.43
  Bottom 0.406: 31.71,9.54 LCD_NODE.1 33.46,9.54 36,7 36,5.25 37.82,3.43 v42.7,3.43
LCD_TX
  Top 0.406: U1.6 44.54,3.71 J1.1
MISO
  Top 0.406: U1.8 ICSP.1
MOSI
  Top 0.406: U1.7 46.01,5 47,5 48.5,3.5 52.25,3.5 54,5.25 54,7.75 53.5,8.25 ICSP.4
N$1
  Top 0.406: LED1.A 17.25,22.55 17.6,22.9 17.6,24.2 18.5,25.1 19.42,25.1 R7.2
N$2
  Top 0.813: POT1.VCC 28.3,23.2 44.6,23.2 47.4,26 POTENTIOMETER.2
N$3
  Top 0.406: U4.P$3 8.94,8.15 SJ1.2
N$4
  Top 0.61: 2.55,3.15 2.1,3.6 R101.1
  Top 0.813: 2.55,3.15 3.3,2.4 8.8,2.4 9.4,3 9.4,3.94 COLORSENSOR.1
N$5
  pour Bottom: 26.5,33 26.3,19 50.1,19.1 50,32.7
  pour Top: 26,19 26.3,32.9 49.8,32.7 50,18.9
N$6
  Bottom 1.27: ULTRASONICSENSOR1.1 80.46,6.66 81.7,7.9 81.7,10.58 JP10.1 JP11.1
N$7
  Top 1.143: JP17.1 79.28,6.82
  Top 1.24: 79.28,6.52 82,3.8
  Top 1.27: 83,3.1 ULTRASONICSENSOR1.2 82.5,2.7 82.5,3.4 82.1,3.8 82,3.8 | 79.28,6.82 79.28,6.52
  Bottom 1.27: JP19.1 JP20.1 JP17.1
N$8
  Bottom 1.27: JP25.1 JP24.1 JP23.1 86.9,3.06 ULTRASONICSENSOR1.3
POT_OUT
  Bottom 0.813: POT1.OUT 33,26 35.54,23.46 POTENTIOMETER.1
RS
  Top 0.305: U1.2 39.5,5.16
  Top 0.406: 39.5,5.16 39.5,3.5 42,1 52.75,1 59.61,7.86 59.61,9.86 62.38,12.63 LCD.4
RST
  Top 0.305: 42,5.75 42,6 41,7 40.2,7 R1.1 35.8,10.5
  Top 0.406: U1.4 42,5.75 42,6.25 42.5,6.75 47,6.75 48,5.75 49.44,5.75 ICSP.5
SCK
  Top 0.406: U1.9 44.54,9.46 45.5,8.5 49.23,8.5 ICSP.3
SCL_3V
  Top 0.305: R2.1 9.6,21.02 9.6,23.4 10.2,24 U2.P$2
  Top 0.406: R2.1 3.1,20.3 2.4,21 Q2.2
SCL_5V  (via drill 0.7)
  Top 0.305: 7.94,12.63 ATTINY85.7 9.22,12.7 12.9,12.7 13.6,12 ICSP1.3
  Top 0.406: Q2.3 5.5,23.2 5.9,22.8 v5.9,22 | U4.P$5 4,7.2 3.6,7.6 3.6,8.6 6.1,11.1 6.1,12.5 | 6.1,12.5 6.1,14.3 v5.9,14.5 6.02,14.62 R5.1 | 7.94,12.63 6.23,12.63 6.1,12.5
  Bottom 0.406: v5.9,22 v5.9,14.5
SDA_3V
  Top 0.305: U2.P$6 13.95,24.65 14.2,24.4 14.2,21.12 R3.1
  Top 0.406: R3.1 18.45,20.3 19.4,19.35 Q1.2
SDA_5V  (via drill 0.6, 0.7)
  Top 0.305: ICSP1.4 16.7,12 17.9,10.8 | Q1.3 v15.94,18.4 | 17.9,10.8 17.9,8.7 17.1,7.9 13.2,7.9 11,10.1 ATTINY85.5 8.1,10.1 | 17.9,10.8 17.9,14.3 18.3,14.7 v18.3,15.7
  Top 0.406: R4.1 6.77,18.1 7.23,17.64 7.23,16.36 v8,15.59 v8.01,15.59 | 8.1,10.1 6.93,10.1 U4.P$4
  Bottom 0.305: v15.94,18.4 15.9,18.2 15.9,17.5 16.7,16.7 17.4,16.7 18.3,15.8 v18.3,15.7
  Bottom 0.406: v8.01,15.59 8.06,15.54 10.24,15.54 13.1,18.4 v15.94,18.4
TRIG
  Top 0.406: ATTINY1.2 55.55,26.55 54.8,25.8 54.8,23.3
  Top 0.61: 54.8,23.3 54.8,22.44 US.2
U_MISO
  Top 0.61: ATTINY1.6 62.99,25.3 64.7,25.3 64.86,25.46 ICSP2.1
U_RST  (via drill 0.6)
  Top 0.406: R6.2 56,28.78 56,27.8 | ATTINY1.1 56,27.8 | 56,27.8 55.2,27.8 v54.6,27.2
  Bottom 0.406: 55,27.2 v54.6,27.2
  Bottom 0.61: v54.6,27.2 57.94,30.54 ICSP2.5
U_SCL
  Top 0.406: ATTINY1.7 63.02,26.6 64.2,26.6 65.6,28 ICSP2.3
  Top 0.61: R9.2 65.92,28 ICSP2.3 66.03,27.8 65.7,27.8 | U5.P$5 59.5,27.3 60.4,26.4 61.4,26.4 61.53,26.54 ATTINY1.7
U_SDA
  Top 0.406: ICSP2.4 69.9,26.57 69.9,24.5 68.6,23.2 67.7,23.2
  Top 0.61: 67.7,23.2 67,23.2 64.3,23.2 63.5,24 ATTINY1.5 61.4,24 58.55,26.85 U5.P$4
  Top 0.813: R10.2 67,21.92 67,23.2
V+
  Top 0.61: U5.P$3 58.51,31.11 SJ2.2
VCC  (via drill 1 pad 0.3)
  Top 0.406: 35.1,8.4 35,8.5 34.55,8.5
  Top 0.61: v39,2 38.19,2.81 U1.1 38.19,6.81 36.25,8.75 | R1.2 34.44,10.86 LCD.15 | POT.P$1 63.25,2.75 64.5,2.75 67,5.25 67,11.25 67.75,12 67.75,15 67.46,14.71 LCD.2 | 35.4,8.25 C1.1
  Top 0.813: R1.2 34.55,8.5 34.55,7.55 34,7 LCD_NODE.2 | 35.4,8.25 35.25,8.4 35.1,8.4 | 36.25,8.75 36,8.5 C1.1
  Bottom 0.61: 55,3 53.75,1.75 39.25,1.75 v39,2 | 55,3 55,10 54.21,10.79 ICSP.2 | POT.P$1 60.25,4 58.75,5.5 57.5,5.5 55,3
VIN
  Top 0.305: ATTINY85.8 | R8.1 1.98,18.1 R4.2
  Top 0.406: ATTINY85.8 10.5,13.9 12.8,16.2 | 12.8,16.2 14.9,16.2 16.27,14.83 ICSP1.2 | U3.3 20.45,10.05 21,9.5 | C3.1 21.4,8.22 21.4,8.7 21,9.1 21,9.5 | U3.1 20.65,11.95 21,11.6 21,9.5 | R4.2 R5.2 4,16.02 4,18.9 4.5,19.4 7,19.4 8.2,18.2 8.2,17.2 9.2,16.2 12.8,16.2
  Top 0.61: C3.1 21.4,8.18 21.4,7.4 20.6,6.6 13.9,6.6 | 11.05,6.95 9.9,8.1 SJ1.1
  Top 0.813: 11.4,6.6 13.9,6.6 | 11.4,6.6 12,6 COLORSENSOR.2 | 11.4,6.6 11.05,6.95
  Bottom 0.61: COLORSENSOR.2 12,5.5 13.7,7.2 18.1,7.2 19.4,8.5 19.4,12.5 17.36,14.54 ICSP1.2
VO
  Top 0.406: POT.P$3 64.92,6.58 LCD.3
VSS  (via drill 0.6)
  Top 0.305: U2.P$3 11.45,23.35 12.7,22.1 13.6,22.1
  Top 0.406: U4.P$6 5.55,6.25 6.5,7.2 U4.P$2
  other vias: 11.1,8.5 20.2,15.8 13,22 17.9,27.2 5.2,26.7
  pour Top: 24,1 0,1 0,31 24,31
  pour Bottom: 0,31 0,1 24,1 24,31

### Text on the board
tPlace: ebots.cc | ebots.cc | ebots.cc | ebots.cc
bPlace: ebots.cc
tNames: COLOUR SENSOR | G | G | POTENTIOMETER | US | V | V | U5 | S | CUSTOM NODE | S | 3-PIN LCD NODE | S | SIGNAL | V | 5V | GND | S | V | G | G | U4 | S | V | G
bNames: ebots.cc | G | V | S | ULTRASONIC / SENSOR | pot